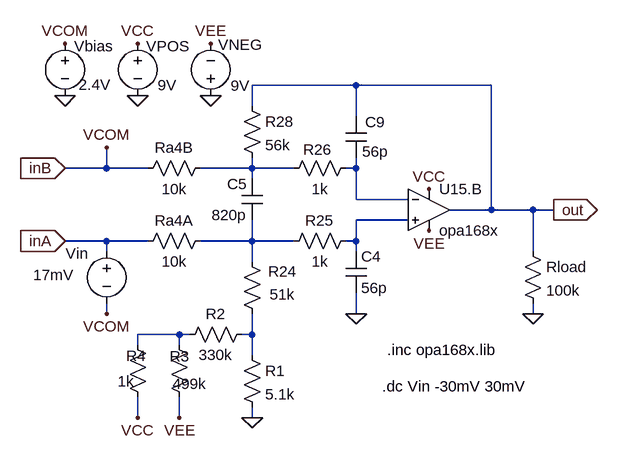
[diagram p0: schematic diff_stage_dc.asc]
diff_stage_dc.asc, the LTspice schematic file:
Version 4.1
SHEET 1 880 680
WIRE 144 -32 -16 -32
WIRE 352 -32 144 -32
WIRE -16 0 -16 -32
WIRE 144 16 144 -32
WIRE -240 96 -240 64
WIRE -240 96 -304 96
WIRE -176 96 -240 96
WIRE -16 96 -16 80
WIRE -16 96 -96 96
WIRE 48 96 -16 96
WIRE 144 96 144 80
WIRE 144 96 128 96
WIRE -16 112 -16 96
WIRE 144 144 144 96
WIRE 224 144 144 144
WIRE 352 160 352 -32
WIRE 352 160 288 160
WIRE 416 160 352 160
WIRE 448 160 416 160
WIRE 224 176 144 176
WIRE -240 208 -304 208
WIRE -176 208 -240 208
WIRE -16 208 -16 176
WIRE -16 208 -96 208
WIRE 48 208 -16 208
WIRE 144 208 144 176
WIRE 144 208 128 208
WIRE -240 224 -240 208
WIRE 144 224 144 208
WIRE 416 224 416 160
WIRE -16 240 -16 208
WIRE -240 320 -240 304
WIRE 144 320 144 288
WIRE 416 320 416 304
WIRE -128 352 -192 352
WIRE -112 352 -128 352
WIRE -16 352 -16 320
WIRE -16 352 -32 352
WIRE -192 368 -192 352
WIRE -128 368 -128 352
WIRE -16 384 -16 352
WIRE -192 480 -192 448
WIRE -128 480 -128 448
WIRE -16 480 -16 464
FLAG 416 320 0
FLAG -304 96 inB
IOPIN -304 96 In
FLAG -304 208 inA
IOPIN -304 208 In
FLAG 448 160 out
IOPIN 448 160 Out
FLAG -80 -16 0
FLAG -192 -16 0
FLAG -304 -16 0
FLAG -304 -96 VCOM
FLAG -240 320 VCOM
FLAG -240 64 VCOM
FLAG 256 128 VCC
FLAG 256 192 VEE
FLAG -80 -96 VEE
FLAG -192 -96 VCC
FLAG 144 320 0
FLAG -16 480 0
FLAG -192 480 VCC
FLAG -128 480 VEE
SYMBOL res -80 80 R90
WINDOW 0 0 56 VBottom 2
WINDOW 3 32 56 VTop 2
SYMATTR InstName Ra4B
SYMATTR Value 10k
SYMATTR SpiceLine tol=1
SYMBOL res 144 80 R90
WINDOW 0 3 59 VBottom 2
WINDOW 3 32 56 VTop 2
SYMATTR InstName R26
SYMATTR Value 1k
SYMATTR SpiceLine tol=1
SYMBOL res 144 192 R90
WINDOW 0 0 56 VBottom 2
WINDOW 3 32 56 VTop 2
SYMATTR InstName R25
SYMATTR Value 1k
SYMATTR SpiceLine tol=1
SYMBOL res 0 336 R180
WINDOW 0 -9 81 Right 2
WINDOW 3 -11 46 Right 2
SYMATTR InstName R24
SYMATTR Value 51k
SYMATTR SpiceLine tol=1
SYMBOL res -32 -16 R0
SYMATTR InstName R28
SYMATTR Value 56k
SYMATTR SpiceLine tol=1
SYMBOL cap 160 80 R180
WINDOW 0 2 55 Right 2
WINDOW 3 7 10 Right 2
SYMATTR InstName C9
SYMATTR Value 56p
SYMATTR SpiceLine V=50 Irms=0 Rser=0 Lser=0
SYMBOL cap 0 176 R180
WINDOW 0 24 56 Left 2
WINDOW 3 24 8 Left 2
SYMATTR InstName C5
SYMATTR Value 820p
SYMATTR SpiceLine V=25 Irms=0 Rser=0 Lser=0
SYMBOL res -80 192 R90
WINDOW 0 0 56 VBottom 2
WINDOW 3 32 56 VTop 2
SYMATTR InstName Ra4A
SYMATTR Value 10k
SYMATTR SpiceLine tol=1
SYMBOL res 400 208 R0
SYMATTR InstName Rload
SYMATTR Value 100k
SYMBOL voltage -240 208 R0
WINDOW 0 -63 19 Left 2
WINDOW 3 -113 52 Left 2
WINDOW 123 38 68 Left 2
WINDOW 39 38 81 Left 2
SYMATTR InstName Vin
SYMATTR Value 17mV
SYMBOL voltage -192 -112 R0
WINDOW 0 13 20 Left 2
WINDOW 3 31 80 Left 2
WINDOW 123 0 0 Left 0
WINDOW 39 24 68 Left 2
SYMATTR InstName VPOS
SYMATTR Value 9V
SYMBOL voltage -80 0 R180
WINDOW 0 -79 94 Left 2
WINDOW 3 -60 31 Left 2
WINDOW 123 0 0 Left 0
WINDOW 39 24 -12 Left 2
SYMATTR InstName VNEG
SYMATTR Value 9V
SYMBOL voltage -304 -112 R0
WINDOW 123 0 0 Left 0
WINDOW 39 24 124 Left 2
WINDOW 0 14 20 Left 2
WINDOW 3 21 79 Left 2
SYMATTR InstName Vbias
SYMATTR Value 2.4V
SYMBOL OpAmps\\opamp2 256 96 R0
SYMATTR InstName U15.B
SYMATTR Value opa168x
SYMBOL cap 128 224 R0
SYMATTR InstName C4
SYMATTR Value 56p
SYMATTR SpiceLine V=50
SYMBOL res -32 368 R0
SYMATTR InstName R1
SYMATTR Value 5.1k
SYMBOL res -16 336 R90
WINDOW 0 0 56 VBottom 2
WINDOW 3 32 56 VTop 2
SYMATTR InstName R2
SYMATTR Value 330k
SYMBOL res -144 352 R0
WINDOW 0 1 34 Left 2
WINDOW 3 6 76 Left 2
SYMATTR InstName R3
SYMATTR Value 499k
SYMBOL res -208 352 R0
WINDOW 0 -2 33 Left 2
WINDOW 3 -15 72 Left 2
SYMATTR InstName R4
SYMATTR Value 1k
TEXT 192 376 Left 2 !.inc opa168x.lib
TEXT 184 432 Left 2 !.dc Vin -30mV 30mV

The netlist it stands for:
* diff_stage_dc.asc
Ra4B N001 VCOM 10k tol=1
R26 N002 N001 1k tol=1
R25 N003 N004 1k tol=1
R24 N006 N004 51k tol=1
R28 out N001 56k tol=1
C9 N002 out 56p V=50 Irms=0 Rser=0 Lser=0
C5 N004 N001 820p V=25 Irms=0 Rser=0 Lser=0
Ra4A N004 inA 10k tol=1
Rload out 0 100k
Vin inA VCOM 17mV
VPOS VCC 0 9V
VNEG 0 VEE 9V
Vbias VCOM 0 2.4V
X§U15.B N003 N002 VCC VEE out opa168x  ; pins In+ In- V+ V- OUT
C4 N003 0 56p V=50
R1 N006 0 5.1k
R2 N006 N005 330k
R3 N005 VEE 499k
R4 N005 VCC 1k
.inc opa168x.lib
.dc Vin -30mV 30mV
.backanno
.end